# Altium project LightLink_V3.PrjPcb
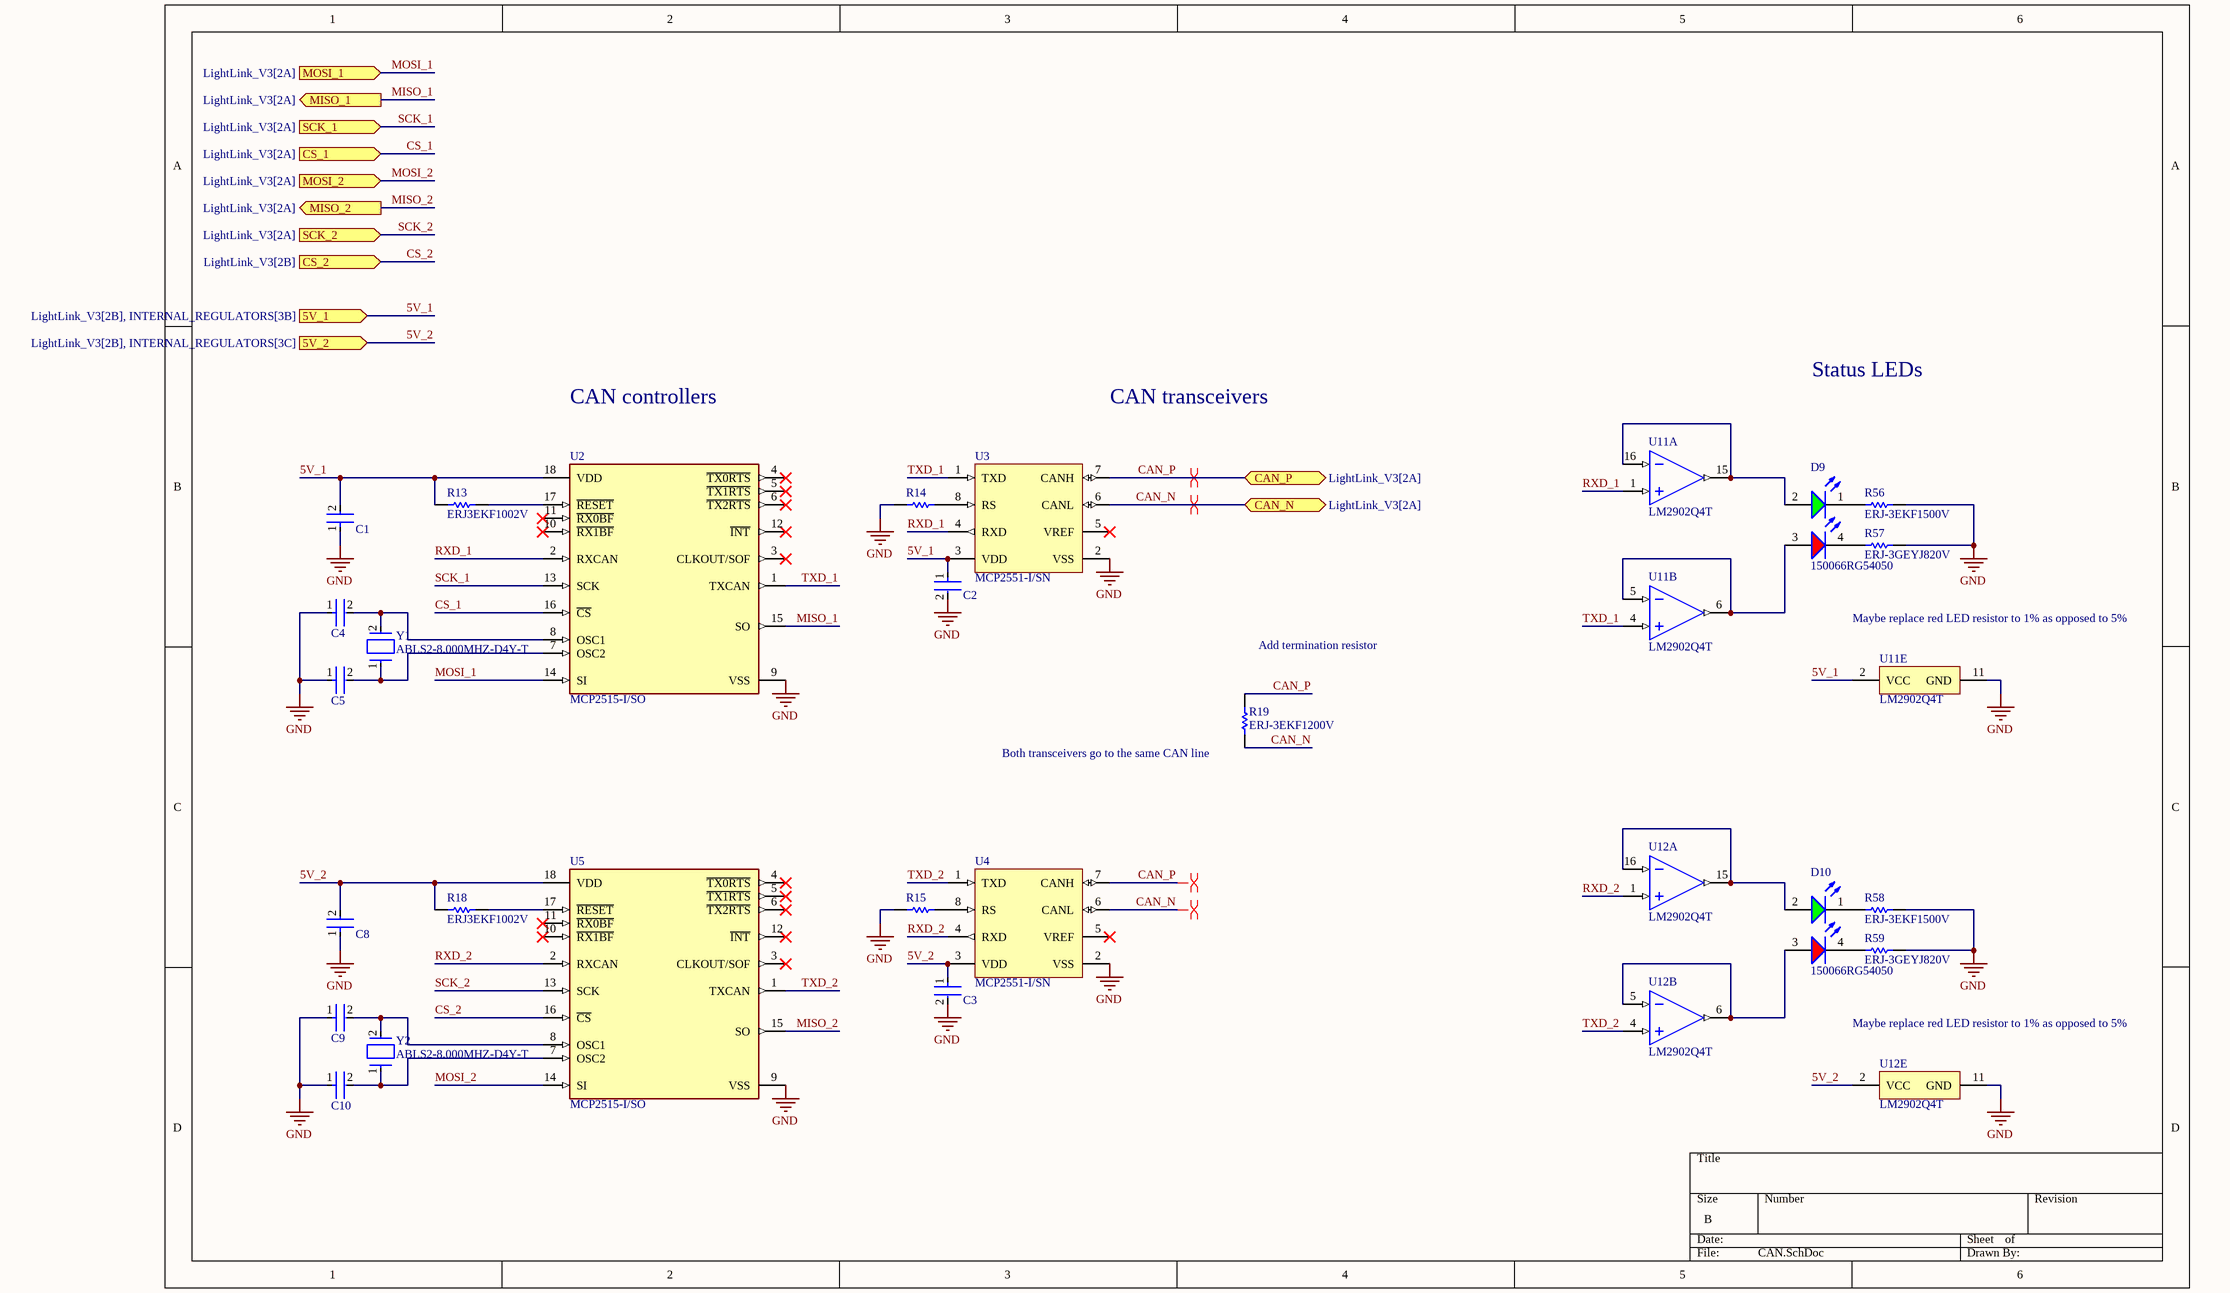
[diagram p0: CAN.SchDoc]
2 sheets, 49 parts. Net scope: flat (ports and power ports of the same name join across sheets).
Board files: LightLink_V3.PcbDoc, LightLink_V3.1.PcbDoc
Sheets:
  CAN.SchDoc
  CAN_SW.SchDoc

## Sheet CAN.SchDoc
size B; SheetNumber: 3; SheetTotal: 6

### Parts
C1  GRM188R60J106ME47D  [FP-GRM188-0_1-e0_2_0_55-IPC_A]  (value not drawn)
C2  C0402C104K8PACTU  [FP-C0402-BB-MFG]  (value not drawn)
C3  C0402C104K8PACTU  [FP-C0402-BB-MFG]  (value not drawn)
C4  GRM188R60J106ME47D  [FP-GRM188-0_1-e0_2_0_55-IPC_A]  (value not drawn)
C5  GRM188R60J106ME47D  [FP-GRM188-0_1-e0_2_0_55-IPC_A]  (value not drawn)
C8  GRM188R60J106ME47D  [FP-GRM188-0_1-e0_2_0_55-IPC_A]  (value not drawn)
C9  GRM188R60J106ME47D  [FP-GRM188-0_1-e0_2_0_55-IPC_A]  (value not drawn)
C10  GRM188R60J106ME47D  [FP-GRM188-0_1-e0_2_0_55-IPC_A]  (value not drawn)
D9  150066RG54050  [WL-SBCD_0606]
D10  150066RG54050  [WL-SBCD_0606]
R13  ERJ3EKF1002V  [RESC1609X55X30LL15T15]
R14  ERJ3EKF1002V  [RESC1609X55X30LL15T15]  (value not drawn)
R15  ERJ3EKF1002V  [RESC1609X55X30LL15T15]  (value not drawn)
R18  ERJ3EKF1002V  [RESC1609X55X30LL15T15]
R19  ERJ-3EKF1200V  [RESC1609X55X30ML15T15]
R56  ERJ-3EKF1500V  [RESC1608X55X30NL15T15]
R57  ERJ-3GEYJ820V  [RESC1608X55X30NL15T15]
R58  ERJ-3EKF1500V  [RESC1608X55X30NL15T15]
R59  ERJ-3GEYJ820V  [RESC1608X55X30NL15T15]
U2  MCP2515-I/SO  [FP-C04-051-MFG]
U3  MCP2551-I/SN  [MCHP-SN8_V]
U4  MCP2551-I/SN  [MCHP-SN8_V]
U5  MCP2515-I/SO  [FP-C04-051-MFG]
U11  LM2902Q4T  [LM2902Q4T-Footprint-1]  (parts A,B,E of 5)
U12  LM2902Q4T  [LM2902Q4T-Footprint-1]  (parts A,B,E of 5)
Y1  ABLS2-8.000MHZ-D4Y-T  [FP-ABLS2-MFG]
Y2  ABLS2-8.000MHZ-D4Y-T  [FP-ABLS2-MFG]

### Ports
5V_1 (in, see LightLink_V3[2B], INTERNAL_REGULATORS[3B]), 5V_2 (in, see LightLink_V3[2B], INTERNAL_REGULATORS[3C]), CAN_N (bidir, see LightLink_V3[2A]), CAN_P (bidir, see LightLink_V3[2A]), CS_1 (in, see LightLink_V3[2A]), CS_2 (in, see LightLink_V3[2B]), MISO_1 (out, see LightLink_V3[2A]), MISO_2 (out, see LightLink_V3[2A]), MOSI_1 (in, see LightLink_V3[2A]), MOSI_2 (in, see LightLink_V3[2A]), SCK_1 (in, see LightLink_V3[2A]), SCK_2 (in, see LightLink_V3[2A])

### Nets
GND: C1.1 C2.2 C3.2 C4.1 C5.1 C8.1 C9.1 C10.1 R14.1 R15.1 R56.2 R57.2 R58.2 R59.2 U2.9(VSS) U3.2(VSS) U4.2(VSS) U5.9(VSS) U11.11(GND) U12.11(GND)
5V_1: C1.2 C2.1 R13.1 U2.18(VDD) U3.3(VDD) U11.2(VCC) ; port 5V_1
5V_2: C3.1 C8.2 R18.1 U4.3(VDD) U5.18(VDD) U12.2(VCC) ; port 5V_2
CAN_N: R19.1 U3.6(CANL) U4.6(CANL) ; port CAN_N
CAN_P: R19.2 U3.7(CANH) U4.7(CANH) ; port CAN_P
CS_1: U2.16(~{CS}) ; port CS_1
CS_2: U5.16(~{CS}) ; port CS_2
MISO_1: U2.15(SO) ; port MISO_1
MISO_2: U5.15(SO) ; port MISO_2
MOSI_1: U2.14(SI) ; port MOSI_1
MOSI_2: U5.14(SI) ; port MOSI_2
RXD_1: U2.2(RXCAN) U3.4(RXD) U11.1(1IN+)
RXD_2: U4.4(RXD) U5.2(RXCAN) U12.1(1IN+)
SCK_1: U2.13(SCK) ; port SCK_1
SCK_2: U5.13(SCK) ; port SCK_2
TXD_1: U2.1(TXCAN) U3.1(TXD) U11.4(2IN+)
TXD_2: U4.1(TXD) U5.1(TXCAN) U12.4(2IN+)
NetC4_2: C4.2 U2.8(OSC1) Y1.2
NetC5_2: C5.2 U2.7(OSC2) Y1.1
NetC9_2: C9.2 U5.8(OSC1) Y2.2
NetC10_2: C10.2 U5.7(OSC2) Y2.1
NetD9_1: D9.1(K) R56.1
NetD9_2: D9.2(A) U11.15(1OUT) U11.16(1IN-)
NetD9_3: D9.3(A) U11.5(2IN-) U11.6(2OUT)
NetD9_4: D9.4(K) R57.1
NetD10_1: D10.1(K) R58.1
NetD10_2: D10.2(A) U12.15(1OUT) U12.16(1IN-)
NetD10_3: D10.3(A) U12.5(2IN-) U12.6(2OUT)
NetD10_4: D10.4(K) R59.1
NetR13_2: R13.2 U2.17(~{RESET})
NetR14_2: R14.2 U3.8(RS)
NetR15_2: R15.2 U4.8(RS)
NetR18_2: R18.2 U5.17(~{RESET})

Not connected (* = marked no-connect by the designer): U2 3(CLKOUT/SOF)* 4(~{TX0RTS})* 5(~{TX1RTS})* 6(~{TX2RTS})* 10(~{RX1BF})* 11(~{RX0BF})* 12(~{INT})*; U3 5(VREF)*; U4 5(VREF)*; U5 3(CLKOUT/SOF)* 4(~{TX0RTS})* 5(~{TX1RTS})* 6(~{TX2RTS})* 10(~{RX1BF})* 11(~{RX0BF})* 12(~{INT})*

### Layout directives
differential pair: CAN_N, CAN_P

### Notes on the sheet
- CAN controllers
- CAN transceivers
- Status LEDs
- Maybe replace red LED resistor to 1% as opposed to 5%
- Add termination resistor
- (near R19) Both transceivers go to the same CAN line

### Library data of the parts
C1 C4 C5 C8-C10 = CMP-2006-02792-2: Chip Multilayer Ceramic Capacitors for General Purpose, 0603, 10uF, X5R, 15%, 20%, 6.3V; Packaging: Tape and Reel; Voltage Rating (DC): 6.3V; Width: 0.031inch; Termination: SMD/SMT; Dielectric: X5R; Package Quantity: 4000; Voltage Rating: 6.3V; Capacitance: 10uF; Case/Package: 0603; Min Operating Temperature: -55°C; Voltage: 6.3V; Length: 1.6mm; Thickness: 0.035inch; Lead Free: Lead Free; Depth: 0.8mm; Case Code (Imperial): 0603; Max Operating Temperature: 85°C; Material: Ceramic; Height: 0.8mm; Tolerance: 20%; Mount: Surface Mount; REACH SVHC: No SVHC; Radiation Hardening: No; Case Code (Metric): 1608
C2 C3 = CMP-2008-02046-2: CAP CER 0.1UF 10V X5R 0402; Manufacturer: Kemet; Material: Ceramic; Capacitance: 0.10 μF; Temperature Coefficient: 15%; Tolerance: 0.1; Value: 0.10 μF; Package: C0402-BB; Temperature: -55°C to +125°C; ComponentLink2Description: Datasheet; Temperature Characteristic: X5R; Device Class L1: Passive Components; Height: 0.55mm; Lead Free: Yes; ComponentLink2URL: https://content.kemet.com/datasheets/KEM_C1002_X7R_SMD.pdf; Device Class L2: Capacitors; Temperature Range Low: -55°C; Temperature Range High: +125°C; RoHS: TRUE; Octopart: https://octopart.com/c0402c104k8pactu-kemet-140039; Automotive: No; Mouser Description: Capacitor 100 nF 10 VDC 0402; Category: Cap; Voltage Rating: 10 V; Digikey Description: CAP CER 0.1UF 10V X5R 0402; Ipc Land Pattern Name: CAPC10050X50; Device Class L3: Ceramic Capacitors; Manufacturer Part Number: C0402C104K8PACTU
D9 D10 = CMP-004-00034-2: Led, Red/Grn, 180Mcd/230Mcd, 624Nm/525Nm Rohs Compliant: Yes
R13-R15 R18 = CMP-1012-00623-3: Chip Resistor, 10 KOhm, +/- 1%, 0.1 W, -55 to 155 degC, 0603 (1608 Metric), RoHS, Tape and Reel; Manufacturer: Panasonic; Voltage Rating: 75V; Case\/Package: 0603; Power Rating: 100mW; Resistance: 10KOhm; Temperature Coefficient: 100ppm\/degreesC; Number of Pins: 2; Package Reference: 603; Depth: 0.8mm; Mount: SurfaceMount; Package Description: 2-Pin Surface Mount Device, Body 1.6 x 0.85 mm; Datasheet Version: 02/2017; Length: 1.6mm; Lead Free: LeadFree; Height: 0.45mm; Number of Terminations: 2; Max Power Dissipation: 100mW; Min Operating Temperature: -55degC; Datasheet URL: https://industrial.panasonic.com/cdbs/www-data/pdf/RDA0000/AOA0000C304.pdf; Termination: SMD/SMT; Case Code (Metric): 1608; Case Code (Imperial): 0603; Tolerance: 1%; Max Operating Temperature: 155degC; RoHSCompliant: true; Voltage Rating (DC): 75V; Radiation Hardening: No; Packaging: TapeandReel; Composition: ThickFilm; Mounting Technology: SurfaceMount; Manufacturer URL: http://www.panasonic.com/; Width: 0.031inch; REACH SVHC: NoSVHC; Contact Plating: Tin; Military Standard: Not; Package Quantity: 1
R19 = CMP-2000-00213-2: Chip Resistor, 120 Ohm, +/- 1%, 0.1 W, -55 to 155 degC, 0603 (1608 Metric), RoHS, Tape and Reel; Manufacturer: Panasonic; Power Rating: 100mW; Voltage Rating (DC): 75V; Resistance: 120Ohm; Temperature Coefficient: 100ppm/degreesC; Number of Terminations: 2; Military Standard: Not; Tolerance: 1%; Min Operating Temperature: -55degC; Packaging: TapeandReel; Lead Free: LeadFree; Max Operating Temperature: 155degC; Manufacturer URL: http://www.panasonic.com/; Case Code (Imperial): 0603; REACH SVHC: NoSVHC; Width: 0.031inch; Datasheet URL: https://industrial.panasonic.com/cdbs/www-data/pdf/RDA0000/AOA0000C283.pdf; RoHSCompliant: true; Max Power Dissipation: 100mW; Termination: SMD/SMT; Package Reference: 0603; Height: 0.022inch; Depth: 0.8mm; Package Description: 2-Pin Surface Mount Device, Body 1.6 x 0.85 mm; Contact Plating: Tin; Length: 1.6mm; Package URL: http://www.st.com/st-web-ui/static/active/en/resource/technical/document/datasheet/CD00001320.pdf; Radiation Hardening: No; Package Quantity: 1; Number of Pins: 2; Datasheet Version: 42095.0; Voltage Rating: 75V; Composition: ThickFilm; Case/Package: 0603; Mount: SurfaceMount; Case Code (Metric): 1608
R56 R58 = CMP-2000-00256-1: Manufacturer: Panasonic; Part Number: ERJ-3EKF1500V
R57 R59 = CMP-1012-00048-2: Manufacturer: Panasonic; Part Number: ERJ-3GEYJ820V
U2 U5 = CMP-0186-00133-3: IC CAN CONTROLLER W/SPI 18SOIC; Manufacturer: Microchip; Min Supply Voltage: 2.7V; Max Supply Voltage: 5.5V; Standoff Height: 0.1mm; Nominal Supply Current: 10mA; Interface: SPI,CAN; Lead Free: Yes; Digikey Description: IC CAN CONTROLLER W/SPI 18SOIC; Category: IC; RoHS: TRUE; Manufacturer Part Number: MCP2515-I/SO; ComponentLink2URL: http://ww1.microchip.com/downloads/en/DeviceDoc/MCP2515-Stand-Alone-CAN-Controller-with-SPI-20001801J.pdf; Mouser Description: CAN Interface IC W/ SPI Interface; Device Class L2: Interface ICs; Package: C04-051; Automotive: No; Function: Controller; Octopart: https://octopart.com/mcp2515-i%2Fso-microchip-430187; Temperature: -40°C to +85°C; Ipc Land Pattern Name: SOIC127P1030X265-18; Ambient Temperature Range Low: -65°C; Height: 2.65mm; Device Class L1: Integrated Circuits (ICs); Ambient Temperature Range High: +125°C; Footprint Url: http://ww1.microchip.com/downloads/en/DeviceDoc/18L_SOIC_Wide_7.50_SO_C04-0051D.pdf; Temperature Range Low: -40°C; Device Class L3: Controllers; Temperature Range High: +85°C; ComponentLink2Description: Datasheet
U3 U4 = CMP-0186-00138-3: High-Speed CAN Transceiver, / 1 Mb/s, 4.5 to 5.5 V, 8-Pin SOIC (SN), Industrial Temperature, RoHS, Tube; Manufacturer: Microchip; RoHSCompliant: true; PackageReference: SN8; ComponentLink1URL: http://www.microchip.com/; DatasheetVersion: Rev. F, 07/2010; ComponentLink2Description: Datasheet; ComponentLink2URL: http://ww1.microchip.com/downloads/en/DeviceDoc/21667f.pdf; ComponentLink3Description: Package Specification; PackageDescription: 8-Pin Small Outline Integrated Circuit, Body 4.9 x 3.9 mm, Pitch 1.27 mm; ComponentLink1Description: Manufacturer URL; Mounting Technology: Surface Mount; ComponentLink3URL: http://www.microchip.com/stellent/groups/techpub_sg/documents/packagingspec/en012702.pdf
U11 U12 = CMP-014-00004-1: LM2902 Series 30 V 1.3 MHz Low-Power Quad Operational Amplifier - QFN-16 (3x3)
Y1 Y2 = CMP-27762-001729-1: CRYSTAL 8.0000MHZ 18PF SMD; Series Resistance: 80R; Tolerance: 30ppm; Frequency: 8MHz; Operating Frequency: 8 MHz; Packaging: Tape and Reel; Number of Pins: 2; Mount: Surface Mount; Package Quantity: 1000; Series: ABLS2; Min Operating Temperature: -40°C; Termination: SMD/SMT; Load Capacitance: 18pF; Lead Free: Lead Free; Frequency Tolerance: 30ppm; RoHS Compliant: Yes; Length: 11.4mm; Width: 4.7mm; Height: 0.13inch; ESR (Equivalent Series Resistance): 80R; Max Operating Temperature: 85°C; Depth: 4.7mm; Frequency Stability: 30ppm

## Sheet CAN_SW.SchDoc
size A; SheetNumber: 6; SheetTotal: 6
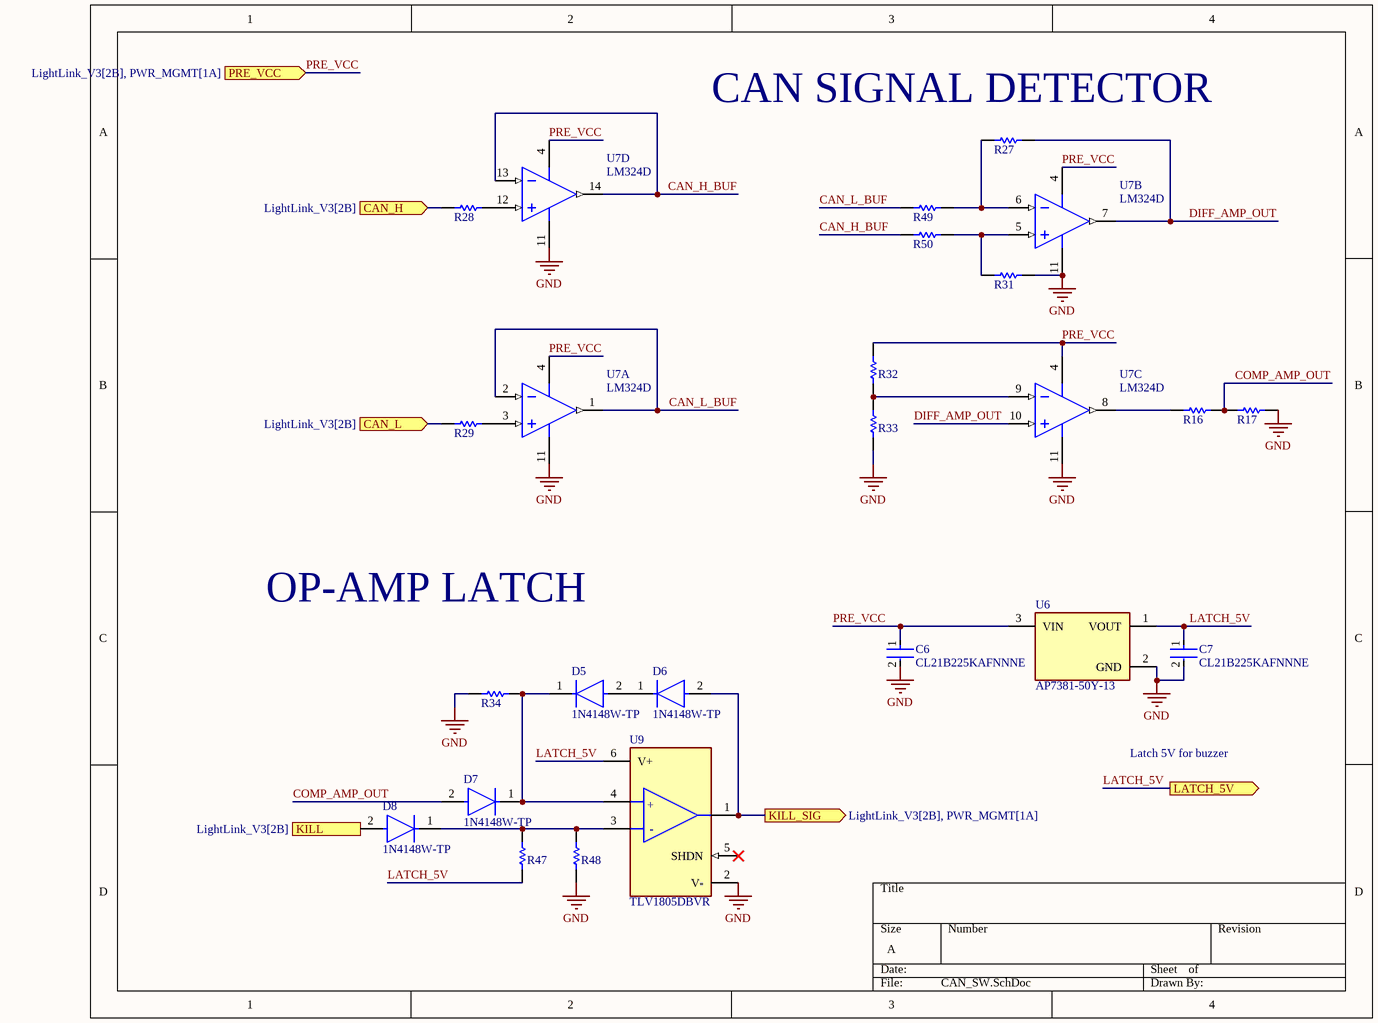
[diagram p1: CAN_SW.SchDoc]

### Parts
C6  CL21B225KAFNNNE  [FP-0805-L_2_01_0_2-W_1_25-IPC_B]
C7  CL21B225KAFNNNE  [FP-0805-L_2_01_0_2-W_1_25-IPC_B]
D5  1N4148W-TP  [FP-SOD-123-IPC_A]
D6  1N4148W-TP  [FP-SOD-123-IPC_A]
D7  1N4148W-TP  [FP-SOD-123-IPC_A]
D8  1N4148W-TP  [FP-SOD-123-IPC_A]
R16  ERJ3EKF1002V  [RESC1609X55X30LL15T15]  (value not drawn)
R17  ERJ3EKF1002V  [RESC1609X55X30LL15T15]  (value not drawn)
R27  ERJ3EKF1002V  [RESC1609X55X30LL15T15]  (value not drawn)
R28  ERJ3EKF1002V  [RESC1609X55X30LL15T15]  (value not drawn)
R29  ERJ3EKF1002V  [RESC1609X55X30LL15T15]  (value not drawn)
R31  ERJ3EKF1002V  [RESC1609X55X30LL15T15]  (value not drawn)
R32  ERJ3EKF1002V  [RESC1609X55X30LL15T15]  (value not drawn)
R33  ERJ-3EKF1001V  [RESC1608X55X30LL15T15]  (value not drawn)
R34  ERJ3EKF1002V  [RESC1609X55X30LL15T15]  (value not drawn)
R47  ERJ3EKF1002V  [RESC1609X55X30LL15T15]  (value not drawn)
R48  ERJ3EKF1002V  [RESC1609X55X30LL15T15]  (value not drawn)
R49  ERJ3EKF1002V  [RESC1609X55X30LL15T15]  (value not drawn)
R50  ERJ3EKF1002V  [RESC1609X55X30LL15T15]  (value not drawn)
U6  AP7381-50Y-13  [FP-SOT89-MFG]
U7  LM324D  [D0014A_L]  (parts A,B,C,D of 4)
U9  TLV1805DBVR  [FP-DBV0006A-IPC_C]

### Ports
CAN_H (in, see LightLink_V3[2B]), CAN_L (in, see LightLink_V3[2B]), KILL (in, see LightLink_V3[2B]), KILL_SIG (out, see LightLink_V3[2B], PWR_MGMT[1A]), LATCH_5V (out), PRE_VCC (in, see LightLink_V3[2B], PWR_MGMT[1A])

### Nets
GND: C6.2 C7.2 R17.1 R31.2 R33.1 R34.2 R48.1 U6.2(GND) U7.11(GND) U9.2(V-)
CAN_H_BUF: R50.1 U7.13(4IN-) U7.14(4OUT)
CAN_L_BUF: R49.1 U7.1(1OUT) U7.2(1IN-)
COMP_AMP_OUT: D7.2(A) R16.1 R17.2
DIFF_AMP_OUT: R27.2 U7.7(2OUT) U7.10(3IN+)
LATCH_5V: C7.1 R47.1 U6.1(VOUT) U9.6(V+) ; port LATCH_5V
PRE_VCC: C6.1 R32.2 U6.3(VIN) U7.4(VCC) ; port PRE_VCC
NetD5_1: D5.1(C) D7.1(C) R34.1 U9.4(+IN)
NetD5_2: D5.2(A) D6.1(C)
NetD6_2: D6.2(A) U9.1(OUT) ; port KILL_SIG
NetD8_1: D8.1(C) R47.2 R48.2 U9.3(-IN)
NetD8_2: D8.2(A) ; port KILL
NetR16_2: R16.2 U7.8(3OUT)
NetR27_1: R27.1 R49.2 U7.6(2IN-)
NetR28_1: R28.1 ; port CAN_H
NetR28_2: R28.2 U7.12(4IN+)
NetR29_1: R29.1 ; port CAN_L
NetR29_2: R29.2 U7.3(1IN+)
NetR31_1: R31.1 R50.2 U7.5(2IN+)
NetR32_1: R32.1 R33.2 U7.9(3IN-)

Not connected (* = marked no-connect by the designer): U9 5(SHDN)*

### Notes on the sheet
- (near R27) CAN SIGNAL DETECTOR
- OP-AMP LATCH
- Latch 5V for buzzer
- (in symbol CMP-04896-000098-1) +; -

### Library data of the parts
C6 C7 = CMP-2007-04514-2: Voltage Rating (DC): 25V; Tolerance: 10%; Capacitance: 2.2uF; Dielectric: X7R; RoHS Compliant: Yes; Lead Free: Lead Free; Packaging: Tape and Reel; Case Code (Imperial): 0805; Case/Package: 0805; Contact Plating: Tin; Mount: Surface Mount; Construction: Flat; Voltage: 25V; REACH SVHC: No SVHC; Thickness: 0.06inch; Depth: 1.25mm; Max Operating Temperature: 125°C; Package Quantity: 3000; Width: 0.049inch; Height: 1.52mm; Case Code (Metric): 2012; Number of Pins: 2; Termination: SMD/SMT; Voltage Rating: 25V; Radiation Hardening: No; Series: FlEXITERM; Length: 2.01mm; Min Operating Temperature: -55°C
D5-D8 = CMP-2000-04993-2: DIODE GEN PURP 100V 150MA SOD123; Max Reverse Leakage Current: 5uA; Max Surge Current: 2A; Reverse Recovery Time: 4ns; Polarity: Standard; Capacitance: 4pF; Max Forward Surge Current (Ifsm): 1A; Element Configuration: Single; Power Dissipation: 400mW; Forward Voltage: 1V; Radiation Hardening: No; Lead Free: Lead Free; Max Reverse Voltage (DC): 100V; Current Rating: 150mA; Forward Current: 150mA; Packaging: Tape and Reel; Number of Pins: 2; Package Quantity: 3000; Max Operating Temperature: 150°C; Min Operating Temperature: -65°C; Average Rectified Current: 150mA; Recovery Time: 4ns; Output Current: 150mA; Peak Non-Repetitive Surge Current: 2A; Width: 1.8mm; Voltage Rating (DC): 100V; Height: 1.2mm; Max Repetitive Reverse Voltage (Vrrm): 100V; Mount: Surface Mount; Length: 2.85mm
R16 R17 R27-R29 R31 R32 R34 R47-R50 = CMP-1012-00623-3: as R13 on sheet CAN; Number of Pins: 2; Package Reference: 603; Depth: 0.8mm; Mount: SurfaceMount; Package Description: 2-Pin Surface Mount Device, Body 1.6 x 0.85 mm; Datasheet Version: 02/2017; Length: 1.6mm; Lead Free: LeadFree; Height: 0.45mm; Number of Terminations: 2; Max Power Dissipation: 100mW; Min Operating Temperature: -55degC; Datasheet URL: https://industrial.panasonic.com/cdbs/www-data/pdf/RDA0000/AOA0000C304.pdf; Termination: SMD/SMT; Case Code (Metric): 1608; Case Code (Imperial): 0603; Tolerance: 1%; Max Operating Temperature: 155degC; RoHSCompliant: true; Voltage Rating (DC): 75V; Radiation Hardening: No; Packaging: TapeandReel; Composition: ThickFilm; Mounting Technology: SurfaceMount; Manufacturer URL: http://www.panasonic.com/; Width: 0.031inch; REACH SVHC: NoSVHC; Contact Plating: Tin; Military Standard: Not; Package Quantity: 1
R33 = CMP-2000-00180-1: Manufacturer: Panasonic; Part Number: ERJ-3EKF1001V
U6 = CMP-12756-000009-1: IC REG LINEAR 5V 150MA SOT89; Manufacturer: Diodes Inc.; Output Type: Fixed; Min Supply Voltage: 3.3V; Max Junction Temp: +125°C; Max Supply Voltage: 40V; Nominal Supply Current: 2.5-25uA; Number Of Outputs: 1; Dropout Voltage: 1000mV; Manufacturer Part Number: AP7381-50Y-13; RoHS: TRUE; Digikey Description: IC REG LINEAR 5V 150MA SOT89; Output Voltage: 5V; Footprint Url: https://www.diodes.com/assets/Package-Files/SOT89.pdf; Category: IC; Temperature: -40°C to +125°C; ComponentLink2Description: Datasheet; Package: SOT89; Temperature Range Low: -40°C; Temperature Range High: +125°C; ComponentLink2URL: https://www.diodes.com/assets/Datasheets/AP7381.pdf; Device Class L1: Integrated Circuits (ICs); Automotive: No; Output Current: 150mA; Ambient Temperature Range High: +85°C; Octopart: https://octopart.com/ap7381-50y-13-diodes+inc.-87775116; Lead Free: Yes; Device Class L2: Power Management ICs; Height: 1.6mm; Device Class L3: Voltage Regulators - Linear; Ambient Temperature Range Low: -40°C
U7 = CMP-2000-06547-1: Quadruple Operational Amplifier, 0.5 V/us, 1.2 MHz, 3 to 32 V, 0 to 70 degC, 14-Pin SOIC (D), Green (RoHS & no Sb/Br), Tube; Manufacturer: Texas Instruments; Unity Gain Bandwidth Product: 1.2MHz; Input Offset Voltage: 7mV; Dual Supply Voltage (Max): ±16V; Single Supply Voltage (Min): 3V; Single Supply Voltage (Max): 32V; Voltage Gain in dB: 100dB; Power Supply Requirement: Single/Dual; Input Bias Current: 250nA; Dual Supply Voltage (Min): ±1.5V; Single Supply Voltage (Typ): 5/9/12/15/18/24/28V; Dual Supply Voltage (Typ): ±3/±5/±9/±12/±15V; Number of  Elements: 4; Common Mode Rejection Ratio: 65dB; Datasheet Version: Rev. W, 03/2015; Technology: Bipolar; Shut Down Feature: No; Package Reference: D0014A; Type: GeneralPurposeAmplifier; Pin Count: 14; Package Type: SOIC; Rail/Rail I/O Type: No; Manufacturer URL: http://www.ti.com/; Package Description: 14-Pin Small Outline Integrated Circuit, Body 8.65 x 3.9 mm, Pitch 1.27 mm; Operating Temperature Classification: Commercial; Datasheet URL: http://www.ti.com/lit/ds/symlink/lm324.pdf; Slew Rate: 0.5V/us; Package URL: http://www.ti.com/lit/ml/mpds177g/mpds177g.pdf; Mounting: SurfaceMount; Packaging: Rail/Tube; Mounting Technology: SurfaceMount; Operating Temp Range: 0Cto70C
U9 = CMP-04896-000098-1: 40V, RAIL-TO-RAIL INPUT, PUSH-PU

## Nets that join several sheets
GND: CAN (20 pins), CAN_SW (10 pins)